# Altium schematic sheet DEBUG_CONSOLE.SchDoc
size 420 x 297 mm; SheetNumber: 17; SheetTotal: 34
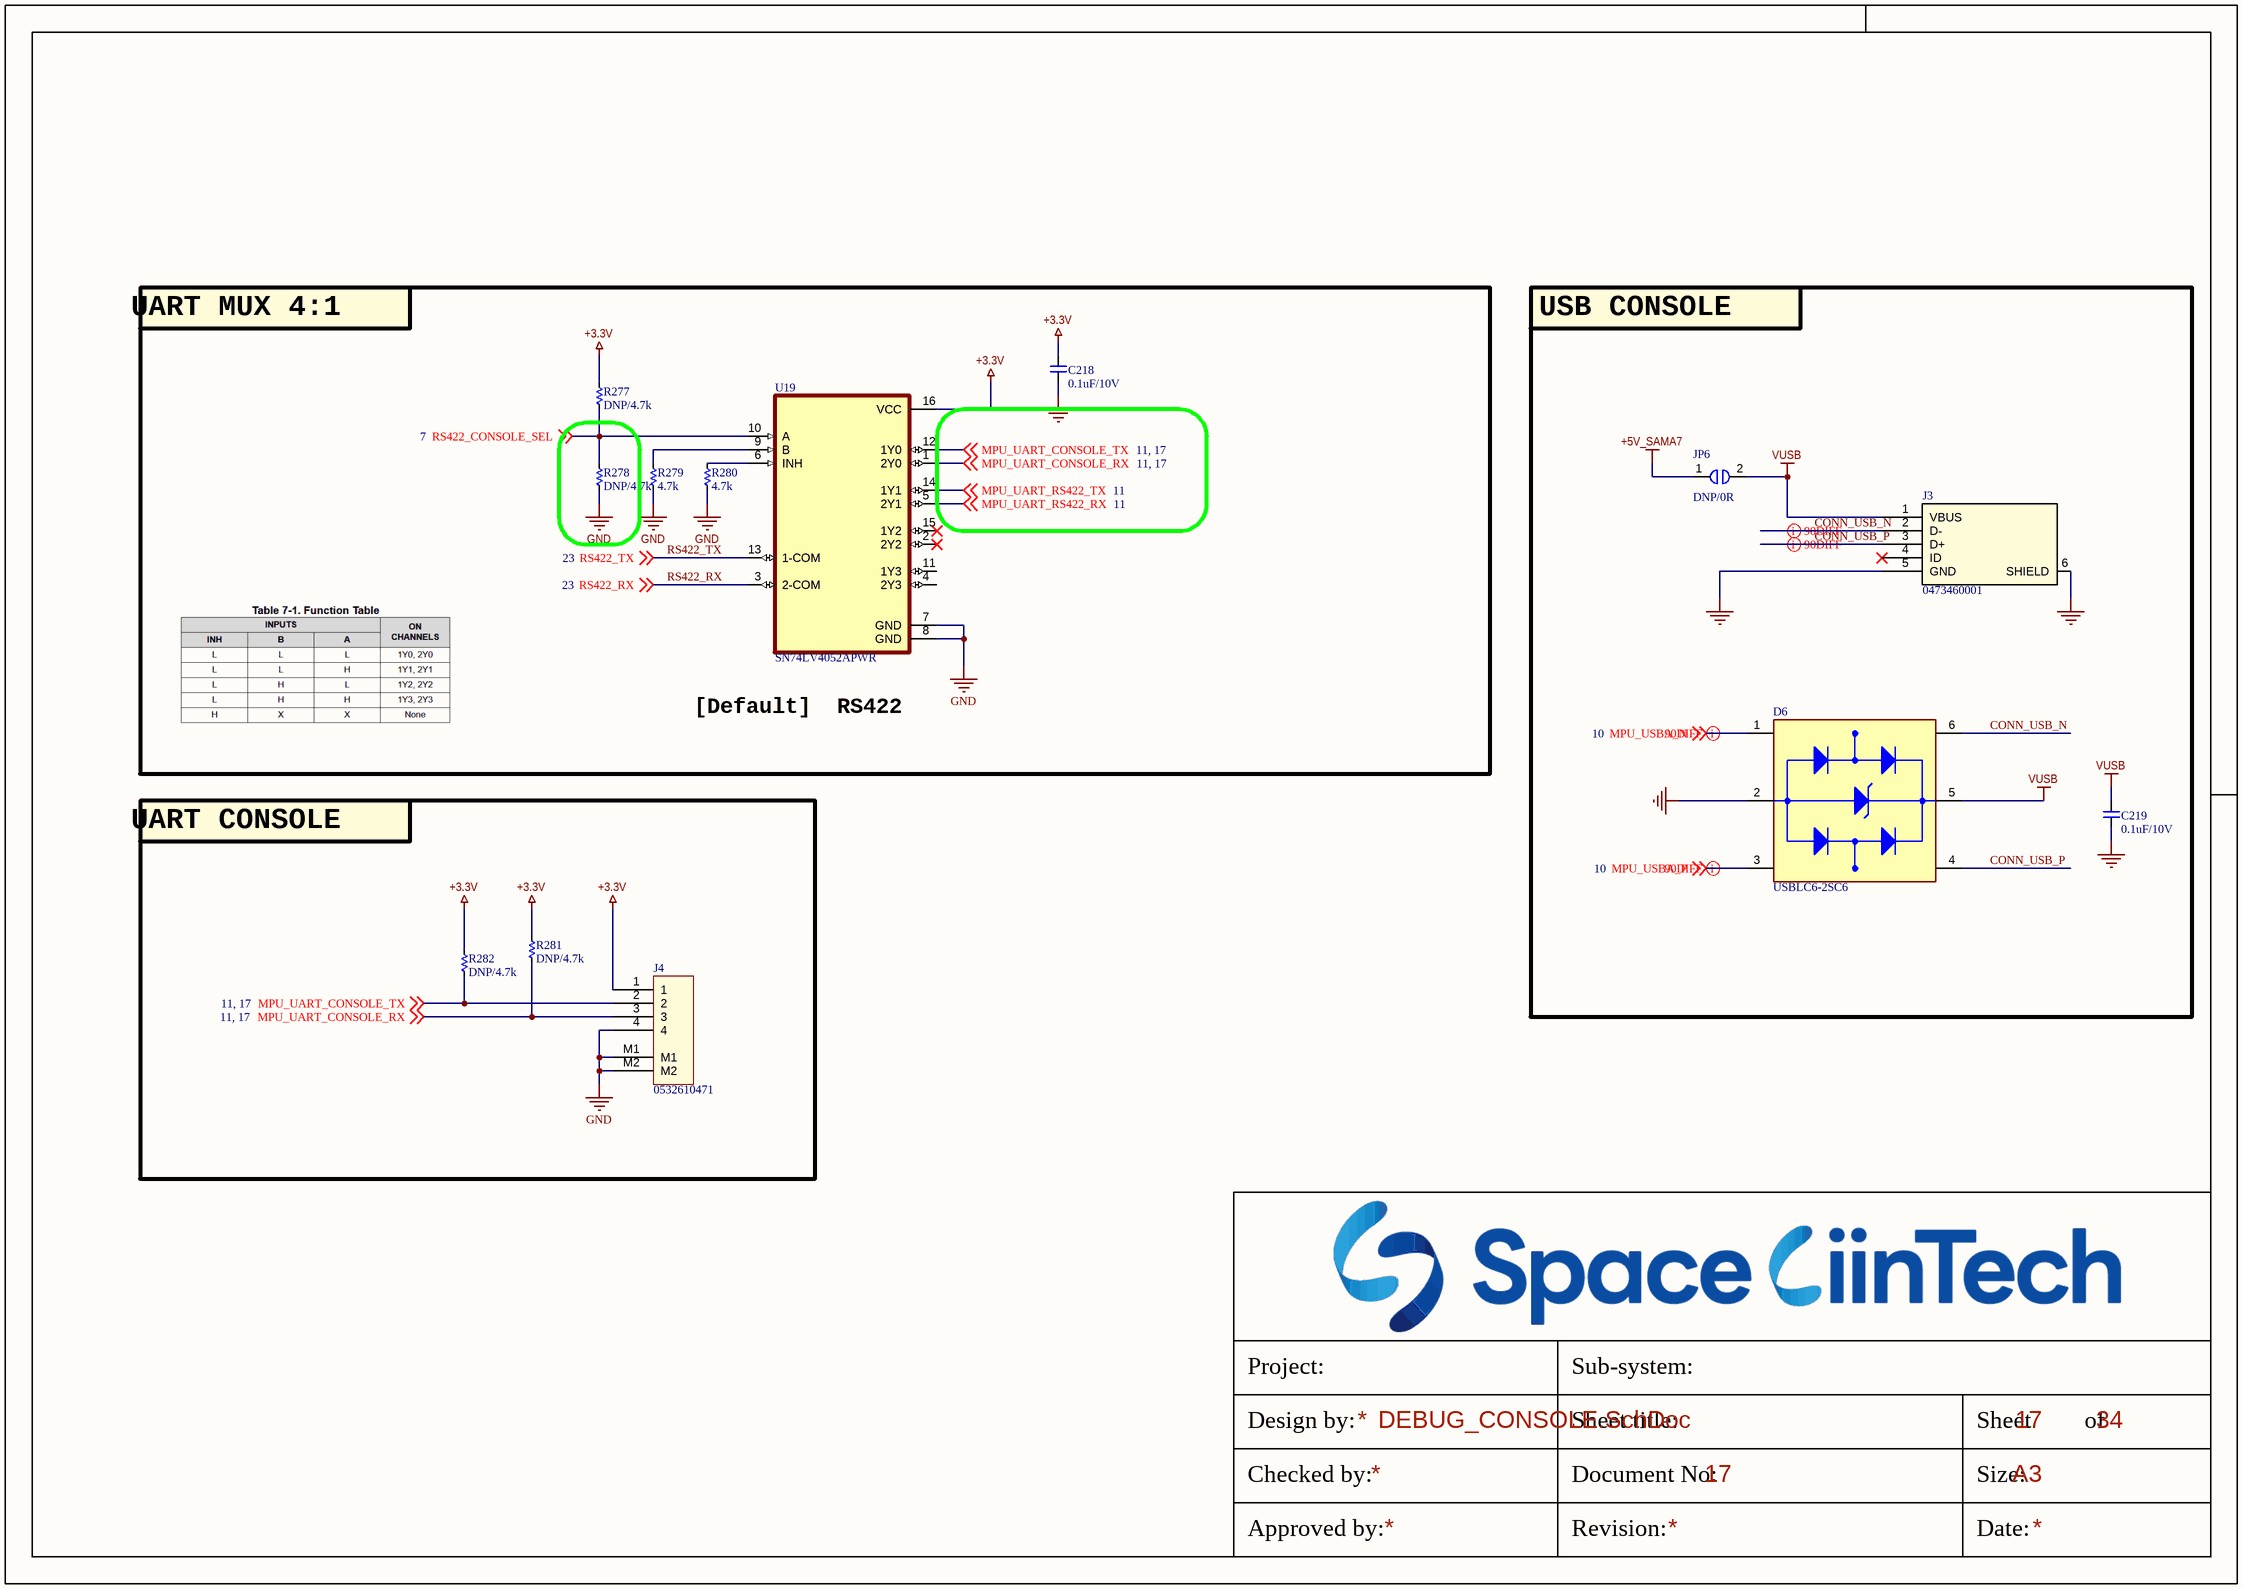
[diagram p0: DEBUG_CONSOLE.SchDoc]

## Parts
C218  0.1uF/10V  [CAP_C_1005X50_L]
C219  0.1uF/10V  [CAP_C_1005X50_L]
D6  USBLC6-2SC6  [SOT95P280X145-6N]
J3  0473460001  [47346-0001_MOL]
J4  0532610471  [MOLEX_0532610471]
JP6  DNP/0R  [RES_C_1608X60]
R277  DNP/4.7k  [RES_C_1005x30_L]
R278  DNP/4.7k  [RES_C_1005x30_L]
R279  4.7k  [RES_C_1005x30_L]
R280  4.7k  [RES_C_1005x30_L]
R281  DNP/4.7k  [RES_C_1005x30_L]
R282  DNP/4.7k  [RES_C_1005x30_L]
U19  SN74LV4052APWR  [SOP65P640X120-16N]

## Blocks framed on the sheet
UART MUX 4:1: C218 R277-R280 U19
USB CONSOLE: C219 D6 J3 JP6
UART CONSOLE: J4 R281 R282

## Nets
+3.3V: C218.2 J4.1 R277.1 R281.1 R282.1 U19.16(VCC)
+5V_SAMA7: JP6.1
GND: C218.1 C219.1 D6.2(GND) J3.5(GND) J3.6(SHIELD) J4.4 J4.M1 J4.M2 R278.2 R279.2 R280.2 U19.7(GND) U19.8(GND)
VUSB: C219.2 D6.5(VBUS) J3.1(VBUS) JP6.2
CONN_USB_N: D6.6(I/O1_OUT) J3.2(D-)
CONN_USB_P: D6.4(I/O2_OUT) J3.3(D+)
MPU_UART_CONSOLE_RX: J4.3 R281.2 U19.1(2Y0) ; off-sheet MPU_UART_CONSOLE_RX
MPU_UART_CONSOLE_TX: J4.2 R282.2 U19.12(1Y0) ; off-sheet MPU_UART_CONSOLE_TX
MPU_UART_RS422_RX: U19.5(2Y1) ; off-sheet MPU_UART_RS422_RX
MPU_UART_RS422_TX: U19.14(1Y1) ; off-sheet MPU_UART_RS422_TX
MPU_USBA_N: D6.1(I/O1_IN) ; off-sheet MPU_USBA_N
MPU_USBA_P: D6.3(I/O2_IN) ; off-sheet MPU_USBA_P
RS422_CONSOLE_SEL: R277.2 R278.1 U19.10(A) ; off-sheet RS422_CONSOLE_SEL
RS422_RX: U19.3(2-COM) ; off-sheet RS422_RX
RS422_TX: U19.13(1-COM) ; off-sheet RS422_TX
NetR279_1: R279.1 U19.9(B)
NetR280_1: R280.1 U19.6(INH)

Not connected (* = marked no-connect by the designer): J3 4(ID)*; U19 2(2Y2)* 4(2Y3) 11(1Y3) 15(1Y2)*

## Layout directives
differential pair; differential pair class DIFF90: CONN_USB_N, CONN_USB_P, MPU_USBA_N, MPU_USBA_P

## Notes on the sheet
- [Default]  RS422
- Project:
- Sub-system:
- Design by:
- Sheet title:
- Sheet
- of
- Checked by:
- Approved by:
- Revision:
- Document No:
- Size:
- Date:
- A3

## Library data of the parts
C218 C219 = _CAP_C_2: CAP
D6 = USBLC6-2SC6: 17V Clamp 5A (8/20Âµs) Ipp Tvs Diode Surface Mount SOT-23-6; MF: STMicroelectronics; Value: *; SnapEDA_Link: https://www.snapeda.com/parts/USBLC6-2SC6/STMicroelectronics/view-part/?ref=snap; Check_prices: https://www.snapeda.com/parts/USBLC6-2SC6/STMicroelectronics/view-part/?ref=eda; Purchase-URL: https://pricing.snapeda.com/search/part/USBLC6-2SC6/?ref=eda; Price: None; Availability: In Stock; Package: SOT-23-6 STMicroelectronics; MP: USBLC6-2SC6
J3 = USB_micro: No Description Available; Mfr_Name: Molex Connector Corporation; RefDes: RefDes; Type: Type
J4 = Header 4x1_2M
JP6 = JUMPER_1_1
R277-R282 = _RES_B_2: RES
U19 = SN74LV4052APWR: 5-V, 4:1, 2-channel analog multiplexer; MF: Texas Instruments; SnapEDA_Link: https://www.snapeda.com/parts/SN74LV4052APWR/Texas+Instruments/view-part/?ref=snap; Package: TSSOP-16 Texas Instruments; Value: *; MP: SN74LV4052APWR; Check_prices: https://www.snapeda.com/parts/SN74LV4052APWR/Texas+Instruments/view-part/?ref=eda